# Altium schematic sheet MIPI_x2CSI.SchDoc
size 420 x 297 mm; Scale: 1:1; DocumentType: Схема электрическая принципиальная; SheetNumber: 23; SheetTotal: 32; DocumentTypeShort: Э3; DocumentInvertoryNumber: ㅤ
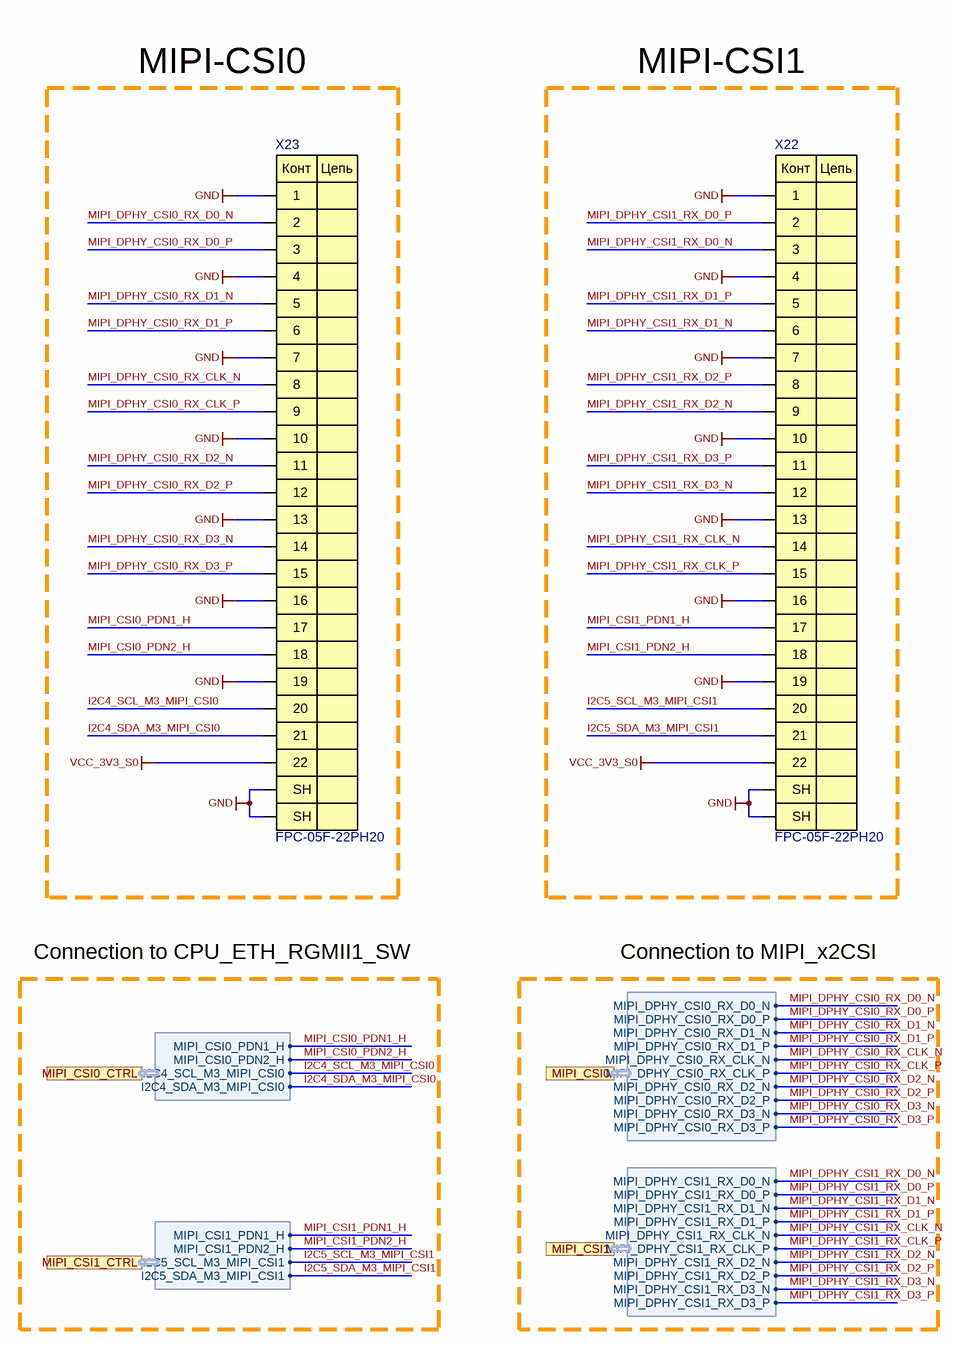
[diagram p0: MIPI_x2CSI.SchDoc]

## Parts
X22  FPC-05F-22PH20  [FPC-05F-22PH20]
X23  FPC-05F-22PH20  [FPC-05F-22PH20]

## Ports
MIPI_CSI0 (harness MIPI_CSI0), MIPI_CSI0_CTRL (harness MIPI_CSI0_CTRL), MIPI_CSI1 (harness MIPI_CSI1), MIPI_CSI1_CTRL (harness MIPI_CSI1_CTRL)

## Harnesses
MIPI_CSI0_CTRL: I2C4_SDA_M3_MIPI_CSI0, I2C4_SCL_M3_MIPI_CSI0, MIPI_CSI0_PDN2_H, MIPI_CSI0_PDN1_H
MIPI_CSI1_CTRL: I2C5_SDA_M3_MIPI_CSI1, I2C5_SCL_M3_MIPI_CSI1, MIPI_CSI1_PDN2_H, MIPI_CSI1_PDN1_H
MIPI_CSI1: MIPI_DPHY_CSI1_RX_D3_P, MIPI_DPHY_CSI1_RX_D3_N, MIPI_DPHY_CSI1_RX_D2_P, MIPI_DPHY_CSI1_RX_D2_N, MIPI_DPHY_CSI1_RX_CLK_P, MIPI_DPHY_CSI1_RX_CLK_N, MIPI_DPHY_CSI1_RX_D1_P, MIPI_DPHY_CSI1_RX_D1_N, MIPI_DPHY_CSI1_RX_D0_P, MIPI_DPHY_CSI1_RX_D0_N
MIPI_CSI0: MIPI_DPHY_CSI0_RX_D3_P, MIPI_DPHY_CSI0_RX_D3_N, MIPI_DPHY_CSI0_RX_D2_P, MIPI_DPHY_CSI0_RX_D2_N, MIPI_DPHY_CSI0_RX_CLK_P, MIPI_DPHY_CSI0_RX_CLK_N, MIPI_DPHY_CSI0_RX_D1_P, MIPI_DPHY_CSI0_RX_D1_N, MIPI_DPHY_CSI0_RX_D0_P, MIPI_DPHY_CSI0_RX_D0_N

## Nets
GND: X22.1 X22.4 X22.7 X22.10 X22.13 X22.16 X22.19 X22.23(SH) X22.24(SH) X23.1 X23.4 X23.7 X23.10 X23.13 X23.16 X23.19 X23.23(SH) X23.24(SH)
VCC_3V3_S0: X22.22 X23.22
I2C4_SCL_M3_MIPI_CSI0: X23.20 ; port MIPI_CSI0_CTRL.I2C4_SCL_M3_MIPI_CSI0
I2C4_SDA_M3_MIPI_CSI0: X23.21 ; port MIPI_CSI0_CTRL.I2C4_SDA_M3_MIPI_CSI0
I2C5_SCL_M3_MIPI_CSI1: X22.20 ; port MIPI_CSI1_CTRL.I2C5_SCL_M3_MIPI_CSI1
I2C5_SDA_M3_MIPI_CSI1: X22.21 ; port MIPI_CSI1_CTRL.I2C5_SDA_M3_MIPI_CSI1
MIPI_CSI0_PDN1_H: X23.17 ; port MIPI_CSI0_CTRL.MIPI_CSI0_PDN1_H
MIPI_CSI0_PDN2_H: X23.18 ; port MIPI_CSI0_CTRL.MIPI_CSI0_PDN2_H
MIPI_CSI1_PDN1_H: X22.17 ; port MIPI_CSI1_CTRL.MIPI_CSI1_PDN1_H
MIPI_CSI1_PDN2_H: X22.18 ; port MIPI_CSI1_CTRL.MIPI_CSI1_PDN2_H
MIPI_DPHY_CSI0_RX_CLK_N: X23.8 ; port MIPI_CSI0.MIPI_DPHY_CSI0_RX_CLK_N
MIPI_DPHY_CSI0_RX_CLK_P: X23.9 ; port MIPI_CSI0.MIPI_DPHY_CSI0_RX_CLK_P
MIPI_DPHY_CSI0_RX_D0_N: X23.2 ; port MIPI_CSI0.MIPI_DPHY_CSI0_RX_D0_N
MIPI_DPHY_CSI0_RX_D0_P: X23.3 ; port MIPI_CSI0.MIPI_DPHY_CSI0_RX_D0_P
MIPI_DPHY_CSI0_RX_D1_N: X23.5 ; port MIPI_CSI0.MIPI_DPHY_CSI0_RX_D1_N
MIPI_DPHY_CSI0_RX_D1_P: X23.6 ; port MIPI_CSI0.MIPI_DPHY_CSI0_RX_D1_P
MIPI_DPHY_CSI0_RX_D2_N: X23.11 ; port MIPI_CSI0.MIPI_DPHY_CSI0_RX_D2_N
MIPI_DPHY_CSI0_RX_D2_P: X23.12 ; port MIPI_CSI0.MIPI_DPHY_CSI0_RX_D2_P
MIPI_DPHY_CSI0_RX_D3_N: X23.14 ; port MIPI_CSI0.MIPI_DPHY_CSI0_RX_D3_N
MIPI_DPHY_CSI0_RX_D3_P: X23.15 ; port MIPI_CSI0.MIPI_DPHY_CSI0_RX_D3_P
MIPI_DPHY_CSI1_RX_CLK_N: X22.14 ; port MIPI_CSI1.MIPI_DPHY_CSI1_RX_CLK_N
MIPI_DPHY_CSI1_RX_CLK_P: X22.15 ; port MIPI_CSI1.MIPI_DPHY_CSI1_RX_CLK_P
MIPI_DPHY_CSI1_RX_D0_N: X22.3 ; port MIPI_CSI1.MIPI_DPHY_CSI1_RX_D0_N
MIPI_DPHY_CSI1_RX_D0_P: X22.2 ; port MIPI_CSI1.MIPI_DPHY_CSI1_RX_D0_P
MIPI_DPHY_CSI1_RX_D1_N: X22.6 ; port MIPI_CSI1.MIPI_DPHY_CSI1_RX_D1_N
MIPI_DPHY_CSI1_RX_D1_P: X22.5 ; port MIPI_CSI1.MIPI_DPHY_CSI1_RX_D1_P
MIPI_DPHY_CSI1_RX_D2_N: X22.9 ; port MIPI_CSI1.MIPI_DPHY_CSI1_RX_D2_N
MIPI_DPHY_CSI1_RX_D2_P: X22.8 ; port MIPI_CSI1.MIPI_DPHY_CSI1_RX_D2_P
MIPI_DPHY_CSI1_RX_D3_N: X22.12 ; port MIPI_CSI1.MIPI_DPHY_CSI1_RX_D3_N
MIPI_DPHY_CSI1_RX_D3_P: X22.11 ; port MIPI_CSI1.MIPI_DPHY_CSI1_RX_D3_P

## Notes on the sheet
- MIPI-CSI0
- MIPI-CSI1
- Connection to CPU_ETH_RGMII1_SW
- Connection to MIPI_x2CSI
- Подп. и дата
- Инв. № дубл.
- Взам. инв. №
- Инв. № подл.
- Изм.
- Лист
- № докум.
- Подп.
- Дата
- Копировал
- Формат А3
- (in symbol FPC-05F-22PH20) Конт; Цепь

## Library data of the parts
X22 X23 = FPC-05F-22PH20: FFC/FPC Connector 22 Position 0.5mm Pitch Bottom Contact Surface Mount, Right Angle -25℃~+85℃; Manufacturer: XUNPU; Check: False; Part Number: FPC-05F-22PH20; Value: FPC-05F-22PH20; NameFromManufacturer: FPC-05F-22PH20